# Altium project gpjtag.PrjPcb
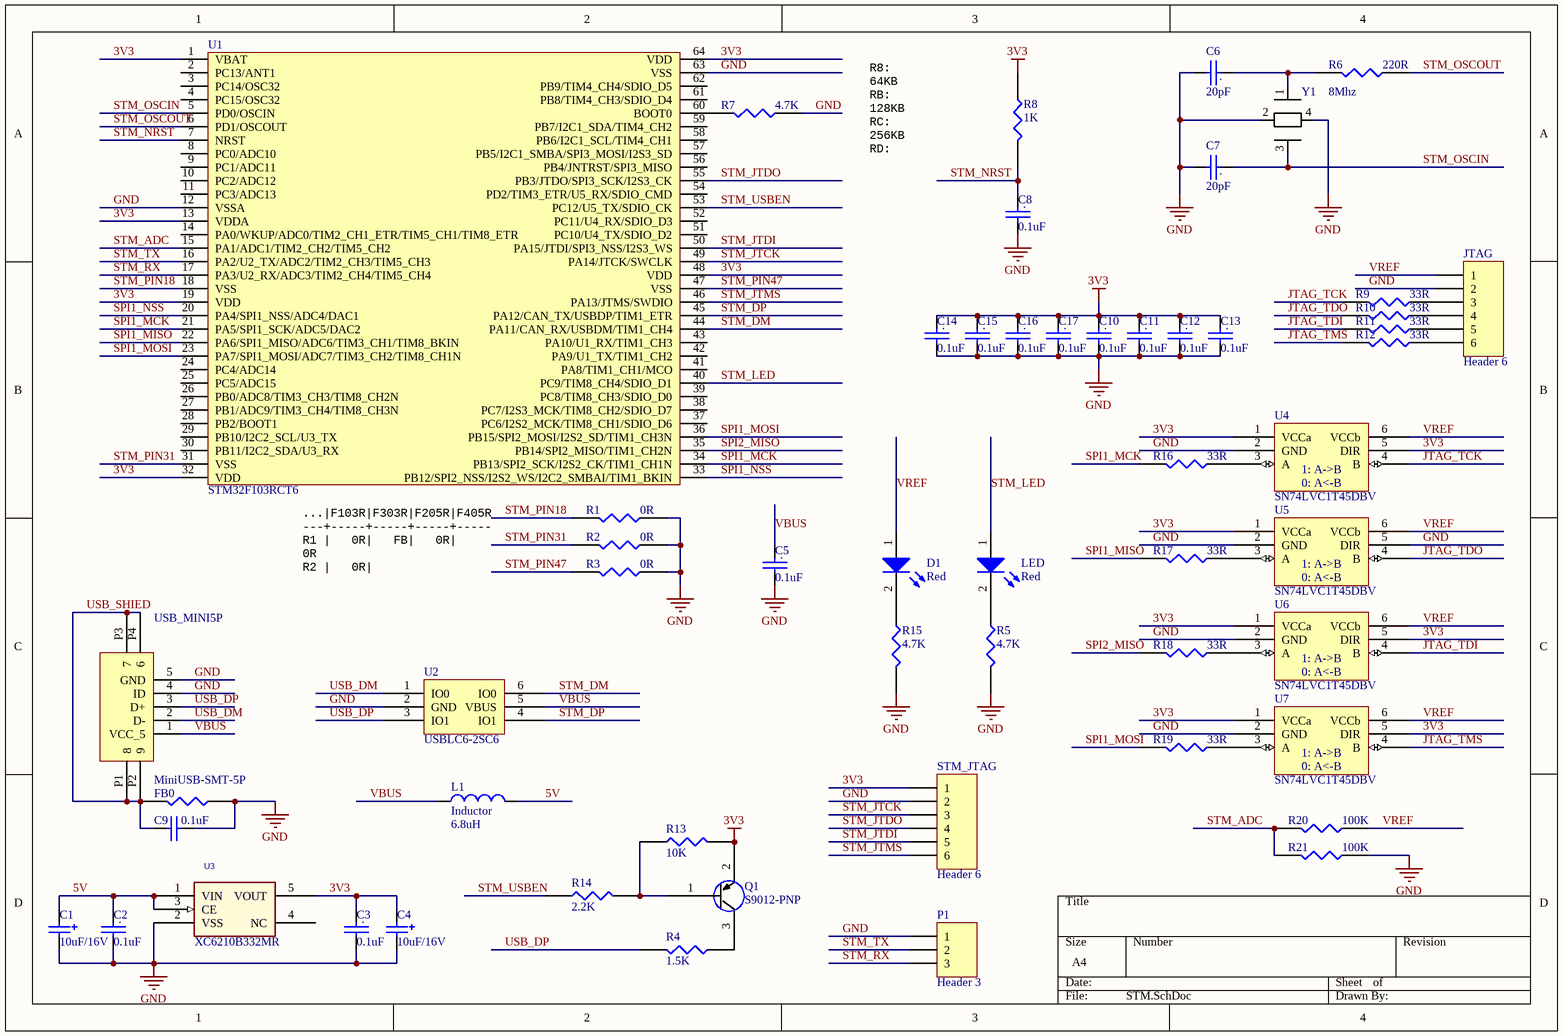
[diagram p0: STM.SchDoc]
1 sheet, 55 parts. Net scope: global (net labels, ports and power ports of the same name join across sheets).
Board file: pcb.PcbDoc

## Sheet STM.SchDoc
size A4

### Parts
C1  value 10uF/16V  [C1206]  (hidden comment: CAP)
C2  value 0.1uF  [C0603]  (hidden comment: CAP Ceramics)
C3  value 0.1uF  [C0603]  (hidden comment: CAP Ceramics)
C4  value 10uF/16V  [C1206]  (hidden comment: CAP)
C5  value 0.1uF  [C0603]  (hidden comment: CAP Ceramics)
C6  value 20pF  [C0603]  (hidden comment: CAP Ceramics)
C7  value 20pF  [C0603]  (hidden comment: CAP Ceramics)
C8  value 0.1uF  [C0603]  (hidden comment: CAP Ceramics)
C9  value 0.1uF  [C0603]  (hidden comment: CAP Ceramics)
C10  value 0.1uF  [C0603]  (hidden comment: CAP Ceramics)
C11  value 0.1uF  [C0603]  (hidden comment: CAP Ceramics)
C12  value 0.1uF  [C0603]  (hidden comment: CAP Ceramics)
C13  value 0.1uF  [C0603]  (hidden comment: CAP Ceramics)
C14  value 0.1uF  [C0603]  (hidden comment: CAP Ceramics)
C15  value 0.1uF  [C0603]  (hidden comment: CAP Ceramics)
C16  value 0.1uF  [C0603]  (hidden comment: CAP Ceramics)
C17  value 0.1uF  [C0603]  (hidden comment: CAP Ceramics)
D1  value Red  [D0603]  (hidden comment: LED)
FB0  RES  [R0603]  (value not drawn)
JTAG  Header 6  [HDR1X6]
L1  Inductor  value 6.8uH  [L1206]
LED  value Red  [D0603]  (hidden comment: LED)
P1  Header 3  [HDR1X3]
Q1  S9012-PNP  [SOT23-3]
R1  value 0R  [R0603]  (hidden comment: Res)
R2  value 0R  [R0603]  (hidden comment: Res)
R3  value 0R  [R0603]  (hidden comment: Res)
R4  value 1.5K  [R0603]  (hidden comment: RES)
R5  value 4.7K  [R0603]  (hidden comment: Res)
R6  value 220R  [R0603]  (hidden comment: Res)
R7  value 4.7K  [R0603]  (hidden comment: Res)
R8  value 1K  [R0603]  (hidden comment: Res)
R9  value 33R  [R0603]  (hidden comment: RES)
R10  value 33R  [R0603]  (hidden comment: RES)
R11  value 33R  [R0603]  (hidden comment: RES)
R12  value 33R  [R0603]  (hidden comment: RES)
R13  value 10K  [R0603]  (hidden comment: RES)
R14  value 2.2K  [R0603]  (hidden comment: RES)
R15  value 4.7K  [R0603]  (hidden comment: Res)
R16  value 33R  [R0603]  (hidden comment: RES)
R17  value 33R  [R0603]  (hidden comment: RES)
R18  value 33R  [R0603]  (hidden comment: RES)
R19  value 33R  [R0603]  (hidden comment: RES)
R20  value 100K  [R0603]  (hidden comment: Res)
R21  value 100K  [R0603]  (hidden comment: Res)
STM_JTAG  Header 6  [HDR1X6]
U1  STM32F103RCT6  [LQFP64_DE12_e0.5_PAD1.8x0.3_offset2.3_mm]
U2  USBLC6-2SC6  [SOT23-6]
U3  value XC6210B332MR  [SOT23-5]  (hidden comment: LDO)
U4  SN74LVC1T45DBV  [SOT23-6]
U5  SN74LVC1T45DBV  [SOT23-6]
U6  SN74LVC1T45DBV  [SOT23-6]
U7  SN74LVC1T45DBV  [SOT23-6]
USB_MINI5P  MiniUSB-SMT-5P  [USB_MINI]
Y1  value 8Mhz  [SMD3225]  (hidden comment: Crystal)

### Nets
3V3: C3.1 C4.1 C10.1 C11.1 C12.1 C13.1 C14.1 C15.1 C16.1 C17.1 Q1.2(e) R8.1 R13.2 STM_JTAG.1 U1.1(VBAT) U1.13(VDDA) U1.19(VDD) U1.32(VDD) U1.48(VDD) U1.64(VDD) U3.5(VOUT) U4.1(VCCa) U4.5(DIR) U5.1(VCCa) U6.1(VCCa) U6.5(DIR) U7.1(VCCa) U7.5(DIR)
GND: C1.2 C2.2 C3.2 C4.2 C5.2 C6.2 C7.2 C8.2 C9.2 C10.2 C11.2 C12.2 C13.2 C14.2 C15.2 C16.2 C17.2 FB0.1 JTAG.2 P1.1 R1.1 R2.1 R3.1 R5.2 R7.1 R15.2 R21.1 STM_JTAG.2 U1.12(VSSA) U1.63(VSS) U2.2(GND) U3.2(VSS) U4.2(GND) U5.2(GND) U5.5(DIR) U6.2(GND) U7.2(GND) USB_MINI5P.4(ID) USB_MINI5P.5(GND) Y1.2 Y1.4
5V: C1.1 C2.1 L1.2 U3.1(VIN) U3.3(CE)
JTAG_TCK: R9.2 U4.4(B)
JTAG_TDI: R11.2 U6.4(B)
JTAG_TDO: R10.2 U5.4(B)
JTAG_TMS: R12.2 U7.4(B)
SPI1_MCK: R16.2 U1.21(PA5/SPI1_SCK/ADC5/DAC2) U1.34(PB13/SPI2_SCK/I2S2_CK/TIM1_CH1N)
SPI1_MISO: R17.2 U1.22(PA6/SPI1_MISO/ADC6/TIM3_CH1/TIM8_BKIN)
SPI1_MOSI: R19.2 U1.23(PA7/SPI1_MOSI/ADC7/TIM3_CH2/TIM8_CH1N) U1.36(PB15/SPI2_MOSI/I2S2_SD/TIM1_CH3N)
SPI1_NSS: U1.20(PA4/SPI1_NSS/ADC4/DAC1) U1.33(PB12/SPI2_NSS/I2S2_WS/I2C2_SMBAI/TIM1_BKIN)
SPI2_MISO: R18.2 U1.35(PB14/SPI2_MISO/TIM1_CH2N)
STM_ADC: R20.2 R21.2 U1.15(PA1/ADC1/TIM2_CH2/TIM5_CH2)
STM_DM: U1.44(PA11/CAN_RX/USBDM/TIM1_CH4) U2.6(IO0)
STM_DP: U1.45(PA12/CAN_TX/USBDP/TIM1_ETR) U2.4(IO1)
STM_JTCK: STM_JTAG.3 U1.49(PA14/JTCK/SWCLK)
STM_JTDI: STM_JTAG.5 U1.50(PA15/JTDI/SPI3_NSS/I2S3_WS)
STM_JTDO: STM_JTAG.4 U1.55(PB3/JTDO/SPI3_SCK/I2S3_CK)
STM_JTMS: STM_JTAG.6 U1.46(PA13/JTMS/SWDIO)
STM_LED: LED.1(A) U1.40(PC9/TIM8_CH4/SDIO_D1)
STM_NRST: C8.1 R8.2 U1.7(NRST)
STM_OSCIN: C7.1 U1.5(PD0/OSCIN) Y1.3
STM_OSCOUT: R6.1 U1.6(PD1/OSCOUT)
STM_PIN18: R1.2 U1.18(VSS)
STM_PIN31: R2.2 U1.31(VSS)
STM_PIN47: R3.2 U1.47(VSS)
STM_RX: P1.3 U1.17(PA3/U2_RX/ADC3/TIM2_CH4/TIM5_CH4)
STM_TX: P1.2 U1.16(PA2/U2_TX/ADC2/TIM2_CH3/TIM5_CH3)
STM_USBEN: R14.1 U1.53(PC12/U5_TX/SDIO_CK)
USB_DM: U2.1(IO0) USB_MINI5P.2(D-)
USB_DP: R4.2 U2.3(IO1) USB_MINI5P.3(D+)
USB_SHIED: C9.1 FB0.2 USB_MINI5P.P1(8) USB_MINI5P.P2(9) USB_MINI5P.P3(7) USB_MINI5P.P4(6)
VBUS: C5.1 L1.1 U2.5(VBUS) USB_MINI5P.1(VCC_5)
VREF: D1.1(A) JTAG.1 R20.1 U4.6(VCCb) U5.6(VCCb) U6.6(VCCb) U7.6(VCCb)
NetC6_1: C6.1 R6.2 Y1.1
NetD1_2: D1.2(K) R15.1
NetJTAG_3: JTAG.3 R9.1
NetJTAG_4: JTAG.4 R10.1
NetJTAG_5: JTAG.5 R11.1
NetJTAG_6: JTAG.6 R12.1
NetLED_2: LED.2(K) R5.1
NetQ1_1: Q1.1(b) R13.1 R14.2
NetQ1_3: Q1.3(c) R4.1
NetR7_2: R7.2 U1.60(BOOT0)
NetR16_1: R16.1 U4.3(A)
NetR17_1: R17.1 U5.3(A)
NetR18_1: R18.1 U6.3(A)
NetR19_1: R19.1 U7.3(A)

Not connected (* = marked no-connect by the designer): U1 2(PC13/ANT1) 3(PC14/OSC32) 4(PC15/OSC32) 8(PC0/ADC10) 9(PC1/ADC11) 10(PC2/ADC12) 11(PC3/ADC13) 14(PA0/WKUP/ADC0/TIM2_CH1_ETR/TIM5_CH1/TIM8_ETR) 24(PC4/ADC14) 25(PC5/ADC15) 26(PB0/ADC8/TIM3_CH3/TIM8_CH2N) 27(PB1/ADC9/TIM3_CH4/TIM8_CH3N) 28(PB2/BOOT1) 29(PB10/I2C2_SCL/U3_TX) 30(PB11/I2C2_SDA/U3_RX) 37(PC6/I2S2_MCK/TIM8_CH1/SDIO_D6) 38(PC7/I2S3_MCK/TIM8_CH2/SDIO_D7) 39(PC8/TIM8_CH3/SDIO_D0) 41(PA8/TIM1_CH1/MCO) 42(PA9/U1_TX/TIM1_CH2) 43(PA10/U1_RX/TIM1_CH3) 51(PC10/U4_TX/SDIO_D2) 52(PC11/U4_RX/SDIO_D3) 54(PD2/TIM3_ETR/U5_RX/SDIO_CMD) 56(PB4/JNTRST/SPI3_MISO) 57(PB5/I2C1_SMBA/SPI3_MOSI/I2S3_SD) 58(PB6/I2C1_SCL/TIM4_CH1) 59(PB7/I2C1_SDA/TIM4_CH2) 61(PB8/TIM4_CH3/SDIO_D4) 62(PB9/TIM4_CH4/SDIO_D5); U3 4(NC)

### Notes on the sheet
- R8:   64KB
  RB:  128KB
  RC:  256KB
  RD:  384KB
  RE:  512KB
  RF:  768KB
  RG: 1024KB
- (near U1) ...|F103R|F303R|F205R|F405R
  ---+-----+-----+-----+-----
  R1 |   0R|   FB|   0R|   0R
  R2 |   0R|   0R|2.2uF|2.2uF
  R3 |   0R|   0R|2.2uF|2.2uF
- (in symbol CAP Ceramics) .
- (in symbol SN74LVC1T45) 1: A->B; 0: A<-B

### Library data of the parts
C1 C4 = CAP Polarity: Polarized Capacitor (Surface Mount); Published: 8-Jun-2000; LatestRevisionDate: 17-Jul-2002; LatestRevisionNote: Re-released for DXP Platform.; PackageReference: C0805; Publisher: Altium Limited
C2 C3 C5-C17 = CAP Ceramics: Capacitor
FB0 = RES: Value: FB
JTAG STM_JTAG = Header 6: Header, 6-Pin; Value: 2.54mm; LatestRevisionDate: 17-Jul-2002; LatestRevisionNote: Re-released for DXP Platform.; Publisher: Altium Limited
L1 = Inductor: Code_IEC: 1005; Published: 8-Jun-2000; LatestRevisionDate: 29-May-2009; LatestRevisionNote: IPC-7351 Footprint Added.; PackageReference: 0402-A; Publisher: Altium Limited; PackageDescription: Chip Inductor; Code_JEITA: 0402
P1 = Header 3: Header, 3-Pin; Value: 2.54mm; LatestRevisionDate: 17-Jul-2002; LatestRevisionNote: Re-released for DXP Platform.; Publisher: Altium Limited
Q1 = S9012: S9012-PNP-SOT23
U1 = STM32F103R: ST STM32 Cortex-M3
U2 = USBLC6-2: USB EMI ESD Protect; Vendor: ST
U3 = XC6210B-3.3: 5V->3.3V; ROOM: POWER
U4-U7 = SN74LVC1T45: TI SN74LVC1T45
USB_MINI5P = MiniUSB_5P: MiniUSB SMT; Value: SMT
Y1 = CRY
D1 LED = LED: Published: 8-Jun-2000; LatestRevisionDate: 17-Dec-2003; LatestRevisionNote: PCB Footprint replaced.; DatasheetVersion: 16-Apr-2002; PackageVersion: 16-Apr-2002; PackageReference: 3.5X2.8X1.9; Publisher: Altium Limited